# Altium schematic sheet IOExpander.SchDoc: I/O Expander
size Letter; ApprovedBy: Kevin Cotton; Author: Jessica Di Stefano; Organization: Cegep Limoilou; Address1: 1300, 8e Avenue; Address2: Québec, QC; Address3: Canada; Address4: G1J 5L5; SheetNumber: 5; SheetTotal: 5
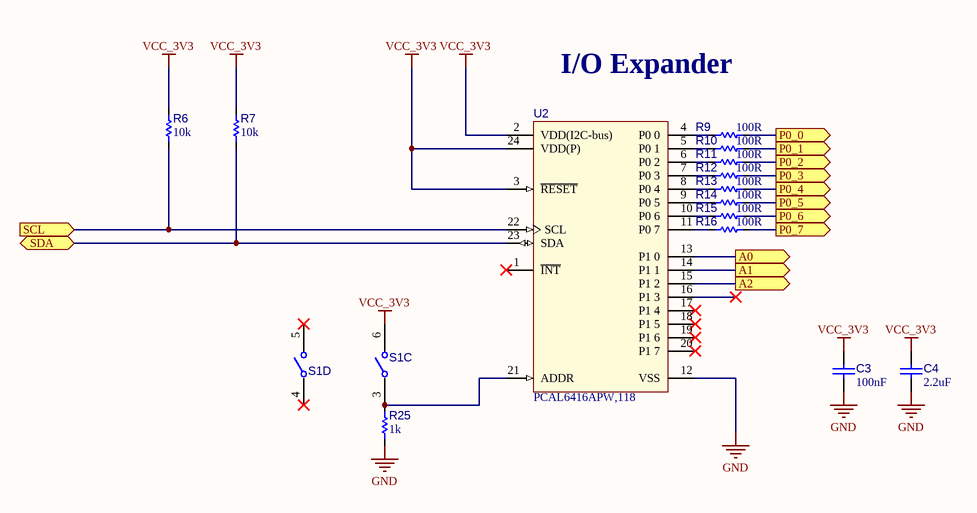
[diagram p0: IOExpander.SchDoc]

## Parts
C3  value 100nF  [C_1608[0603]]  (hidden comment: CAP CER 100nF 50V 0603)
C4  value 2.2uF  [C_1608[0603]]  (hidden comment: CAP CER 2.2uF 10V X7R 0603)
R6  value 10k  [R_1608[0603]]  (hidden comment: Res 10k 1% 0603)
R7  value 10k  [R_1608[0603]]  (hidden comment: Res 10k 1% 0603)
R9  value 100R  [R_1608[0603]]  (hidden comment: Res 100R 1% 0603)
R10  value 100R  [R_1608[0603]]  (hidden comment: Res 100R 1% 0603)
R11  value 100R  [R_1608[0603]]  (hidden comment: Res 100R 1% 0603)
R12  value 100R  [R_1608[0603]]  (hidden comment: Res 100R 1% 0603)
R13  value 100R  [R_1608[0603]]  (hidden comment: Res 100R 1% 0603)
R14  value 100R  [R_1608[0603]]  (hidden comment: Res 100R 1% 0603)
R15  value 100R  [R_1608[0603]]  (hidden comment: Res 100R 1% 0603)
R16  value 100R  [R_1608[0603]]  (hidden comment: Res 100R 1% 0603)
R25  value 1k  [R_1608[0603]]  (hidden comment: Res 1k 1% 0603)
S1  DSHP04TSGER  [S_DIP_SWITCH_50MIL_4POS]  (value not drawn)  (parts C,D of 4)
U2  PCAL6416APW,118  [U_TSSOP24_SOT355-1-IPC_B]

## Ports
A0 (out), A1 (out), A2 (out), P0_0 (out), P0_1 (out), P0_2 (out), P0_3 (out), P0_4 (out), P0_5 (out), P0_6 (out), P0_7 (out), SCL (in), SDA (bidir)

## Nets
GND: C3.1 C4.1 R25.1 U2.12(VSS)
VCC_3V3: C3.2 C4.2 R6.2 R7.2 S1.6 U2.2(VDD(I2C-bus)) U2.3(~{RESET}) U2.24(VDD(P))
A0: U2.13(P1_0) ; port A0
A1: U2.14(P1_1) ; port A1
A2: U2.15(P1_2) ; port A2
P0_0: R9.2 ; port P0_0
P0_1: R10.2 ; port P0_1
P0_2: R11.2 ; port P0_2
P0_3: R12.2 ; port P0_3
P0_4: R13.2 ; port P0_4
P0_5: R14.2 ; port P0_5
P0_6: R15.2 ; port P0_6
P0_7: R16.2 ; port P0_7
SCL: R6.1 U2.22(SCL) ; port SCL
SDA: R7.1 U2.23(SDA) ; port SDA
NetR9_1: R9.1 U2.4(P0_0)
NetR10_1: R10.1 U2.5(P0_1)
NetR11_1: R11.1 U2.6(P0_2)
NetR12_1: R12.1 U2.7(P0_3)
NetR13_1: R13.1 U2.8(P0_4)
NetR14_1: R14.1 U2.9(P0_5)
NetR15_1: R15.1 U2.10(P0_6)
NetR16_1: R16.1 U2.11(P0_7)
NetR25_2: R25.2 S1.3 U2.21(ADDR)

Not connected (* = marked no-connect by the designer): S1 4* 5*; U2 1(~{INT})* 16(P1_3)* 17(P1_4)* 18(P1_5)* 19(P1_6)* 20(P1_7)*

## Notes on the sheet
- I/O Expander
- Titre :
- Conception :
- Date :
- Approbation :
- Heure :
- Révision :
- Feuille
- de
- Fichier :

## Library data of the parts
C3 = CAP002: Capacitor type 1; Manufacturer 1: Yageo; Manufacturer Part Number 1: CC0603KRX7R9BB104; LibRef: CAP002; Code CEGEP: COND0143SM; Tolerance: 10%; Dielectric: X7R; Rated Voltage: 50V; Mounting Technology: SMT; Supplier 1: LCSC; Supplier Part Number 1: C14663
C4 = CAP022: Capacitor type 1; Manufacturer 1: Samsung; Manufacturer Part Number 1: CL10B225KP8NNNC; LibRef: CAP022; Tolerance: 10%; Rated Voltage: 10V; Dielectric: X7R; Mounting Technology: SMT; Supplier 1: LCSC; Supplier Part Number 1: C100082
R6 R7 = RES001: Resistor type 1; Manufacturer 1: Yageo; Manufacturer Part Number 1: RC0603FR-0710KL; LibRef: RES001; Code CEGEP: RESI0238-0603; Puissance: 1/10W; Max Working Voltage: 75V; Tolerance: 1%; Mounting Technology: SMT; Supplier 1: LCSC; Supplier Part Number 1: C98220
R9-R16 = RES029: Resistor type 1; Manufacturer 1: Yageo; Manufacturer Part Number 1: RC0603FR-07100RL; LibRef: RES029; Puissance: 1/10W; Max Working Voltage: 75V; Tolerance: 1%; Mounting Technology: SMT; Supplier 1: LCSC; Supplier Part Number 1: C105588
R25 = RES015: Resistor type 1; Manufacturer 1: Yageo; Manufacturer Part Number 1: RC0603FR-071KL; LibRef: RES015; Puissance: 1/10W; Max Working Voltage: 75V; Tolerance: 1%; Mounting Technology: SMT; Supplier 1: LCSC; Supplier Part Number 1: C22548
S1 = SW_DIP_50MIL_4POS: SWITCH DIP SLIDE SPST 25MA 24V, pitch 1.27mm, height 1.55mm; Manufacturer 1: kangshen; Value: DIP Switch 4pos; Manufacturer 2: Omron; Manufacturer Part Number 1: DSHP04TSGER; Manufacturer Part Number 2: A6H-4102-PM; Mounting Technology: SMT; Supplier 1: LCSC; Supplier 2: LCSC; Supplier Part Number 1: C3293144; Supplier Part Number 2: C2733274; Supplier 3: Digikey; Supplier Part Number 3: 39-A6H-4102-PMCT-ND
U2 = U_PCAL6416APW: IC I/O EXPANDER 16BIT 24TSSOP; Manufacturer Part Number 1: TCA6416APWR; Manufacturer 1: Texas Instruments; Manufacturer 2: NXP Semiconductors; Manufacturer Part Number 2: PCAL6416APW,118; Mounting Technology: SMT; Supplier 1: LCSC; Supplier 2: LCSC; Supplier 3: Digikey; Supplier Part Number 1: C130203; Supplier Part Number 2: C2652299; Supplier Part Number 3: 568-9922-1-ND